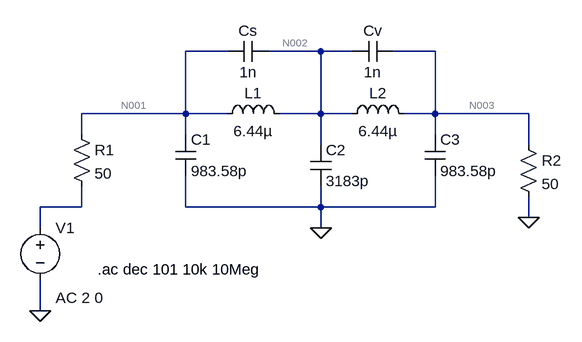
[diagram p0: schematic Passive LC Filter Circuit.asc]
Passive LC Filter Circuit.asc, the LTspice schematic file:
Version 4
SHEET 1 880 680
WIRE 160 16 96 16
WIRE 304 16 224 16
WIRE 352 16 304 16
WIRE 480 16 416 16
WIRE 96 112 96 16
WIRE 96 112 -64 112
WIRE 160 112 96 112
WIRE 304 112 304 16
WIRE 304 112 240 112
WIRE 352 112 304 112
WIRE 480 112 480 16
WIRE 480 112 432 112
WIRE 624 112 480 112
WIRE -64 144 -64 112
WIRE 96 144 96 112
WIRE 480 144 480 112
WIRE 304 160 304 112
WIRE 624 160 624 112
WIRE -64 256 -64 224
WIRE -64 256 -128 256
WIRE 96 256 96 208
WIRE 304 256 304 224
WIRE 304 256 96 256
WIRE 480 256 480 208
WIRE 480 256 304 256
WIRE 624 272 624 240
WIRE -128 288 -128 256
WIRE 304 288 304 256
WIRE -128 416 -128 368
FLAG 304 288 0
FLAG -128 416 0
FLAG 624 272 0
SYMBOL cap 80 144 R0
SYMATTR InstName C1
SYMATTR Value 983.58p
SYMBOL ind 144 128 R270
WINDOW 0 32 56 VTop 2
WINDOW 3 5 56 VBottom 2
SYMATTR InstName L1
SYMATTR Value 6.44µ
SYMBOL cap 288 160 R0
SYMATTR InstName C2
SYMATTR Value 3183p
SYMBOL ind 336 128 R270
WINDOW 0 32 56 VTop 2
WINDOW 3 5 56 VBottom 2
SYMATTR InstName L2
SYMATTR Value 6.44µ
SYMBOL cap 464 144 R0
SYMATTR InstName C3
SYMATTR Value 983.58p
SYMBOL cap 224 0 R90
WINDOW 0 0 32 VBottom 2
WINDOW 3 32 32 VTop 2
SYMATTR InstName Cs
SYMATTR Value 1n
SYMBOL cap 416 0 R90
WINDOW 0 0 32 VBottom 2
WINDOW 3 32 32 VTop 2
SYMATTR InstName Cv
SYMATTR Value 1n
SYMBOL res -80 128 R0
SYMATTR InstName R1
SYMATTR Value 50
SYMBOL voltage -128 272 R0
WINDOW 123 24 124 Left 2
WINDOW 39 0 0 Left 0
SYMATTR Value2 AC 2 0
SYMATTR InstName V1
SYMATTR Value ""
SYMBOL res 608 144 R0
SYMATTR InstName R2
SYMATTR Value 50
TEXT -40 352 Left 2 !.ac dec 101 10k 10Meg

The netlist it stands for:
* Passive LC Filter Circuit.asc
C1 N001 0 983.58p
L1 N001 N002 6.44µ
C2 N002 0 3183p
L2 N002 N003 6.44µ
C3 N003 0 983.58p
Cs N002 N001 1n
Cv N003 N002 1n
R1 N001 N004 50
V1 N004 0 AC 2 0
R2 N003 0 50
.ac dec 101 10k 10Meg
.backanno
.end

* Results of the author's LTspice run, read from the files saved beside the schematic
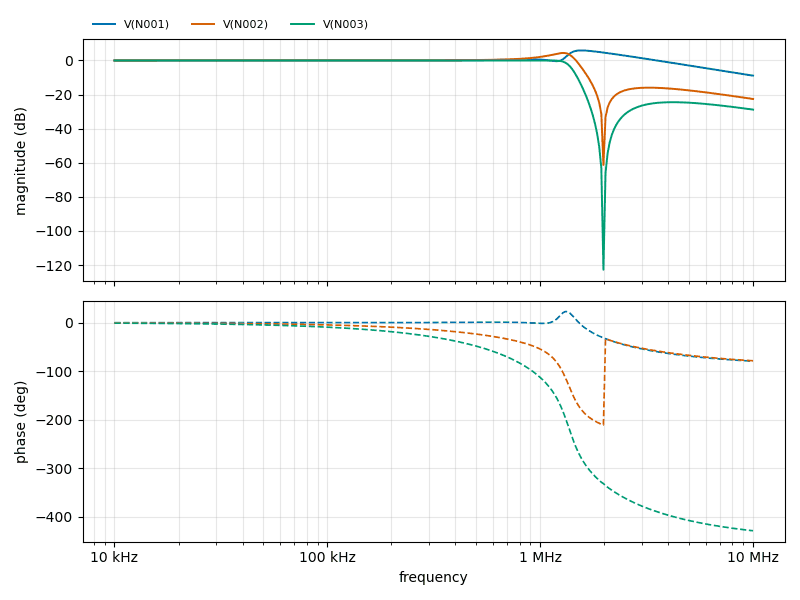
[diagram p1: AC Analysis of Passive LC Filter Circuit.asc, plotted from the saved traces]
* AC Analysis, 1 run:
*   V(N001): 0.00 dB at 10 kHz, -8.91 dB at 10 MHz, peak 5.91 dB at 1.542 MHz, 3 dB below the peak at 1.341 MHz and 2.487 MHz
*   V(N002): 0.00 dB at 10 kHz, -22.59 dB at 10 MHz, peak 4.41 dB at 1.285 MHz, 3 dB below the peak at 896.4 kHz and 1.437 MHz
*   V(N003): -0.00 dB at 10 kHz, -28.83 dB at 10 MHz, peak -0.00 dB at 10 kHz, 3 dB below the peak at 1.368 MHz